# Altium schematic sheet Sheet1.SchDoc
size A; SheetNumber: 1; SheetTotal: 1
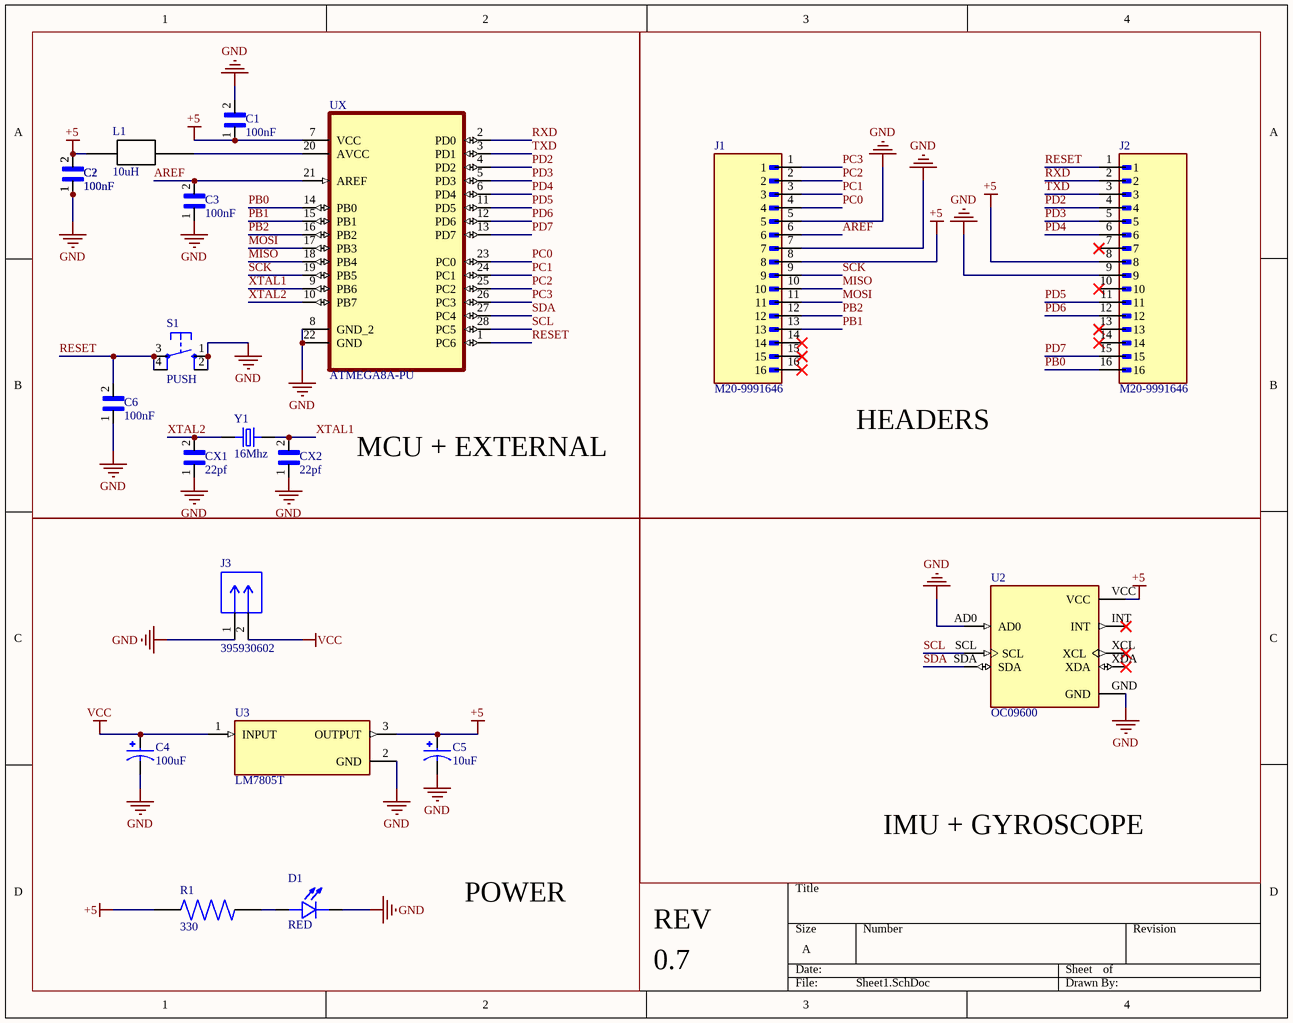
[diagram p0: Sheet1.SchDoc]

## Parts
C1  100nF  [CAPRR508W50L508T318H762]
C2  100nF  [CAPRR508W50L508T318H762]
C3  100nF  [CAPRR508W50L508T318H762]
C4  100uF  [CAPPRD250W50D630H1120]
C5  10uF  [CAPPRD200W50D500H1100]
C6  100nF  [CAPRR508W50L508T318H762]
C?  100nF  [CAPRR508W50L508T318H762]
CX1  22pf  [CAPRR508W50L508T318H762]
CX2  22pf  [CAPRR508W50L508T318H762]
D1  RED  [LEDRD254W51D580H870]
J1  M20-9991646  [HARWIN_M20-9991646]
J2  M20-9991646  [HARWIN_M20-9991646]
J3  395930602  [CONN_SD-39543-004_NONE_02P_MOL]
L1  10uH  [RESAD700W45L350D185]
R1  330  [RESAD700W45L350D185]
S1  PUSH  [B3F-1020]
U2  OC09600  [MODULE_OC09600]
U3  LM7805T  [TO254P1011X457X1950-3]
UX  ATMEGA8A-PU  [DIP254P762X457-28]
Y1  16Mhz  [XTAL_ECS-160-18-4X-EM]

## Blocks framed on the sheet
MCU + EXTERNAL: C1-C3 C6 C? CX1 CX2 L1 S1 UX Y1
HEADERS: J1 J2
POWER: C4 C5 D1 J3 R1 U3
IMU + GYROSCOPE: U2

## Nets
+5: C1.1 C2.2 C5.P C?.2 J1.8 J2.8 L1.1 R1.1 U2.VCC U3.3(OUTPUT) UX.7(VCC)
GND: C1.2 C2.1 C3.1 C4.N C5.N C6.1 C?.1 CX1.1 CX2.1 D1.2(C) J1.5 J1.7 J2.9 J3.1 S1.1(S) S1.2(S1) U2.AD0 U2.GND U3.2(GND) UX.8(GND_2) UX.22(GND)
VCC: C4.P J3.2 U3.1(INPUT)
AREF: C3.2 J1.6 UX.21(AREF)
MISO: J1.10 UX.18(PB4)
MOSI: J1.11 UX.17(PB3)
PB0: J2.16 UX.14(PB0)
PB1: J1.13 UX.15(PB1)
PB2: J1.12 UX.16(PB2)
PC0: J1.4 UX.23(PC0)
PC1: J1.3 UX.24(PC1)
PC2: J1.2 UX.25(PC2)
PC3: J1.1 UX.26(PC3)
PD2: J2.4 UX.4(PD2)
PD3: J2.5 UX.5(PD3)
PD4: J2.6 UX.6(PD4)
PD5: J2.11 UX.11(PD5)
PD6: J2.12 UX.12(PD6)
PD7: J2.15 UX.13(PD7)
RESET: C6.2 J2.1 S1.3(P) S1.4(P1) UX.1(PC6)
RXD: J2.2 UX.2(PD0)
SCK: J1.9 UX.19(PB5)
SCL: U2.SCL UX.28(PC5)
SDA: U2.SDA UX.27(PC4)
TXD: J2.3 UX.3(PD1)
XTAL1: CX2.2 UX.9(PB6) Y1.2
XTAL2: CX1.2 UX.10(PB7) Y1.1
NetD1_1: D1.1(A) R1.2
NetL1_2: L1.2 UX.20(AVCC)

Not connected (* = marked no-connect by the designer): J1 14* 15* 16*; J2 7* 10* 13* 14*; U2 INT* XCL* XDA*

## Notes on the sheet
- REV
- 0.7

## Library data of the parts
C1-C3 C6 C? = AR215C104K4R: AR 100nF Ceramic Multilayer Cap,50V dc,+125C,X7R Dielectric,+/-10%,Through Hole | AVX AR215C104K4R; SnapEDA_Link: https://www.snapeda.com/parts/AR215C104K4R/AVX/view-part/?ref=snap; Package: Radial AVX; Value: *; MF: AVX; MP: AR215C104K4R; Check_prices: https://www.snapeda.com/parts/AR215C104K4R/AVX/view-part/?ref=eda
C4 = EEUHD1E101: Ø®Ø§Ø²Ù† Ù‡Ø§ÛŒ Ø§Ù„Ú©ØªØ±ÙˆÙ„ÛŒØªÛŒ Ø¢Ù„ÙˆÙ…ÛŒÙ†ÛŒÙˆÙ…ÛŒ 100F 25V Ø´Ø¹Ø§Ø¹ÛŒØŒ Ù‚ÙˆØ·ÛŒ 1000 Ø³Ø§Ø¹Øª @ 105C; MP: EEU-HD1E101; MF: Panasonic; Purchase-URL: https://pricing.snapeda.com/search/part/EEU-HD1E101/?ref=eda; Value: *; SnapEDA_Link: https://www.snapeda.com/parts/EEU-HD1E101/Panasonic/view-part/?ref=snap; Price: None; Package: RADIAL-2 Panasonic; Check_prices: https://www.snapeda.com/parts/EEU-HD1E101/Panasonic/view-part/?ref=eda; Availability: In Stock
C5 = ECA1CM100: 10F 16V Aluminum Electrolytic Capacitors Radial, Can 2000 Hrs @ 85C; MF: Panasonic; MP: ECA-1CM100; Check_prices: https://www.snapeda.com/parts/ECA-1CM100/Panasonic/view-part/235834/?ref=eda; Value: *; Purchase-URL: https://pricing.snapeda.com/search/part/ECA-1CM100/?ref=eda; Package: RADIAL-2 Panasonic; Price: None; Availability: In Stock; SnapEDA_Link: https://www.snapeda.com/parts/ECA-1CM100/Panasonic/view-part/235834/?ref=snap
CX1 CX2 = AR215C104K4R: MF: AVX; SnapEDA_Link: https://www.snapeda.com/parts/AR215C104K4R/AVX/view-part/?ref=snap; Package: Radial AVX; Value: *; MP: AR215C104K4R; Check_prices: https://www.snapeda.com/parts/AR215C104K4R/AVX/view-part/?ref=eda
D1 = OVLFR3C7: Red 5 mm 30Â° Clear 5000 mcd 2.2 V Round LED Lamp Through Hole; MF: Optek; SnapEDA_Link: https://www.snapeda.com/parts/OVLFR3C7/Optek/view-part/?ref=snap; Package: Radial Optek; Value: *; MP: OVLFR3C7; Check_prices: https://www.snapeda.com/parts/OVLFR3C7/Optek/view-part/?ref=eda
J1 J2 = M20-9991646: 2.54mm (0.1) Pitch SIL Vertical Throughboard Pin Header, 6.1mm mating pin height, tin, 16 contacts; MF: Harwin; SnapEDA_Link: https://www.snapeda.com/parts/M20-9991646/Harwin/view-part/?ref=snap; Package: None; Value: *; MP: M20-9991646; Check_prices: https://www.snapeda.com/parts/M20-9991646/Harwin/view-part/?ref=eda
L1 = FERRITE BEAD 10uH: FERRITE BEAD; Power_Rating: .25 W; MF: TE Connectivity; MP: 2-1623927-3; Voltage_Rating: 200 V; Tolerance: 5%; SnapEDA_Link: https://www.snapeda.com/parts/2-1623927-3/TE+Connectivity/view-part/?ref=snap; Package: None; Reactance: 10uH; Value: *; EU_RoHS_Compliance: Compliant; Check_prices: https://www.snapeda.com/parts/2-1623927-3/TE+Connectivity/view-part/?ref=eda
R1 = 2-1623927-3: Carbon Film Resistors - Through Hole 1K Ohm 5% 1/4W Res Carbon Film; Power_Rating: .25 W; MF: TE Connectivity; Voltage_Rating: 200 V; SnapEDA_Link: https://www.snapeda.com/parts/2-1623927-3/TE+Connectivity/view-part/?ref=snap; Package: None; Resistance: 1K; Value: *; MP: 2-1623927-3; EU_RoHS_Compliance: Compliant; Tolerance: 5%; Check_prices: https://www.snapeda.com/parts/2-1623927-3/TE+Connectivity/view-part/?ref=eda
S1 = B3F-1020: Switch Tactile N.O. SPST Flat Round Button PC Pins 0.05A 24VDC 0.98N Thru-Hole Bag; MF: Omron; MP: B3F1020; SnapEDA_Link: https://www.snapeda.com/parts/B3F1020/Omron/view-part/?ref=snap; Package: None; Value: *; Check_prices: https://www.snapeda.com/parts/B3F1020/Omron/view-part/?ref=eda
U2 = OC09600: GY-521 6 DOF MPU-6050 Module 3 Axis Accelerometer Gyroscope Module for Arduino; MF: YKS; SnapEDA_Link: https://www.snapeda.com/parts/OC09600/YKS/view-part/?ref=snap; Package: None; Value: *; MP: OC09600; Check_prices: https://www.snapeda.com/parts/OC09600/YKS/view-part/?ref=eda
U3 = LM7805T: 3-Terminal 1.5A Positive Fixed Voltage Regulator; MF: TAEJIN; SnapEDA_Link: https://www.snapeda.com/parts/LM7805T/TAEJIN/view-part/?ref=snap; Package: TO-220-3 TAEJIN; Value: *; MP: LM7805T; Check_prices: https://www.snapeda.com/parts/LM7805T/TAEJIN/view-part/?ref=eda
UX = ATMEGA8A-PU: AVR AVRÂ® ATmega Microcontroller IC 8-Bit 16MHz 8KB (4K x 16) FLASH 28-PDIP; MF: Microchip; SnapEDA_Link: https://www.snapeda.com/parts/ATMEGA8A-PU/Microchip/view-part/?ref=snap; Package: PDIP-28 TE Connectivity; Value: *; MP: ATMEGA8A-PU; Check_prices: https://www.snapeda.com/parts/ATMEGA8A-PU/Microchip/view-part/?ref=eda
Y1 = ECS-160-18-4X-EM: 16 MHz Â±30ppm Crystal 18pF 40 Ohms HC-49/US; MF: ECS Inc.; SnapEDA_Link: https://www.snapeda.com/parts/ECS-160-18-4X-EM/ECS/view-part/?ref=snap; Package: HC-49USX-4X-2 ECS; Value: *; MP: ECS-160-18-4X-EM; Check_prices: https://www.snapeda.com/parts/ECS-160-18-4X-EM/ECS/view-part/?ref=eda
J3 = 395930602: Package: None; Price: None; Value: *; MP: 395930602; Availability: Unavailable